# EAGLE design i2c_dev (EAGLE 8.6.0)
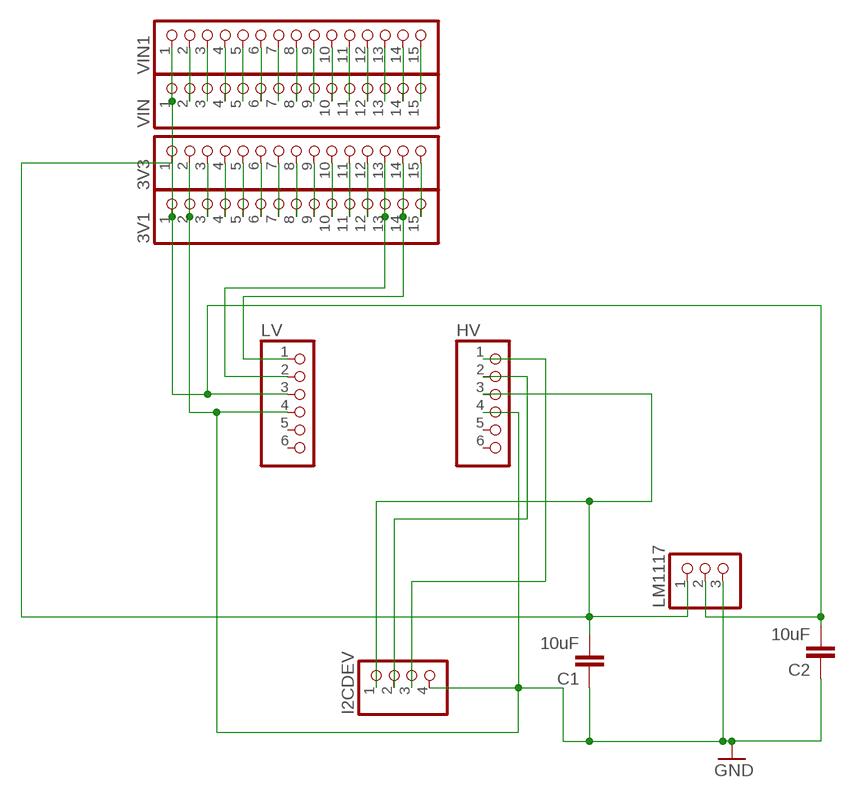
[diagram p0: schematic, sheet 1]

## Parts
3V1  PINHD-1X15  [1X15]
3V3  PINHD-1X15  [1X15]
C1  10uF  C-EU025-025X050  [C025-025X050]
C2  10uF  C-EU025-025X050  [C025-025X050]
HV  PINHD-1X6  [1X06]
I2CDEV  PINHD-1X4  [1X04]
LM1117  PINHD-1X3  [1X03]
LV  PINHD-1X6  [1X06]
VIN  PINHD-1X15  [1X15]
VIN1  PINHD-1X15  [1X15]

## Nets
GND: 3V1.2 3V3.2 C1.1 C2.1 HV.4 I2CDEV.4 LM1117.3 LV.4
I2C_DEV: HV.2 I2CDEV.2
N$1: 3V1.14 3V3.14 LV.1
N$2: 3V1.1 3V3.1 C2.2 LM1117.2 LV.3
N$3: C1.2 HV.3 I2CDEV.1 LM1117.1 VIN1.1 VIN.1
N$4: HV.1 I2CDEV.3
N$6: 3V1.13 3V3.13 LV.2
N$7: VIN1.15 VIN.15
N$8: VIN1.14 VIN.14
N$9: VIN1.13 VIN.13
N$10: VIN1.12 VIN.12
N$11: VIN1.11 VIN.11
N$12: VIN1.10 VIN.10
N$13: VIN1.9 VIN.9
N$14: VIN1.8 VIN.8
N$15: VIN1.7 VIN.7
N$16: VIN1.6 VIN.6
N$17: VIN1.5 VIN.5
N$18: VIN1.4 VIN.4
N$19: VIN1.3 VIN.3
N$20: VIN1.2 VIN.2
N$21: 3V1.3 3V3.3
N$22: 3V1.4 3V3.4
N$23: 3V1.5 3V3.5
N$24: 3V1.6 3V3.6
N$25: 3V1.7 3V3.7
N$26: 3V1.8 3V3.8
N$27: 3V1.9 3V3.9
N$28: 3V1.10 3V3.10
N$29: 3V1.11 3V3.11
N$30: 3V1.12 3V3.12
N$31: 3V1.15 3V3.15
Unconnected: HV.5 HV.6 LV.5 LV.6

## Library data of the parts
3V1 3V3 VIN VIN1 = pinhead:PINHD-1X15: PIN HEADER
C1 C2 = resistor:C-EU: CAPACITOR, European symbol
HV LV = pinhead:PINHD-1X6: PIN HEADER
I2CDEV = pinhead:PINHD-1X4: PIN HEADER
LM1117 = pinhead:PINHD-1X3: PIN HEADER

## Board
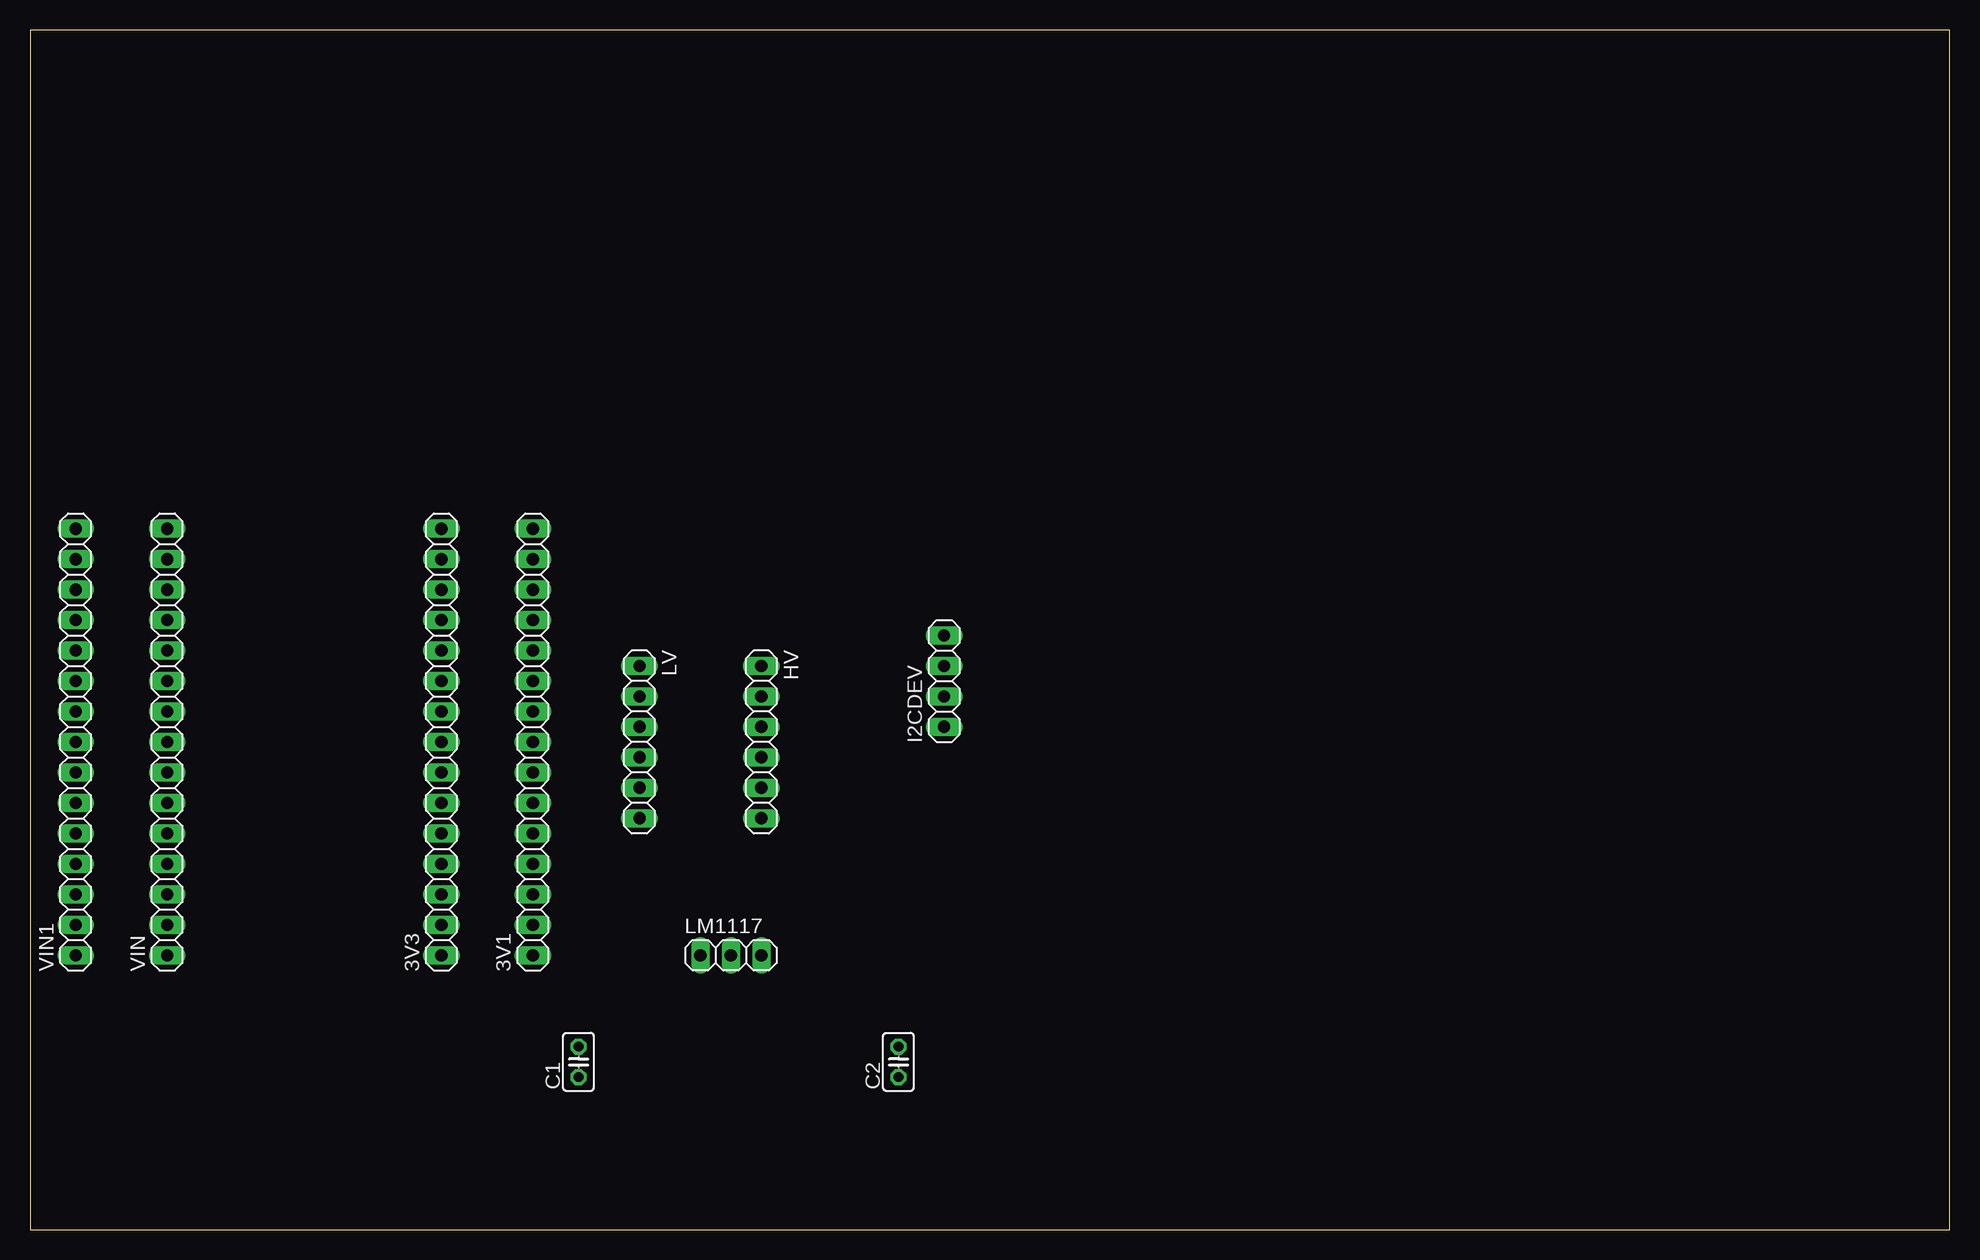
[diagram p1: board, top side]
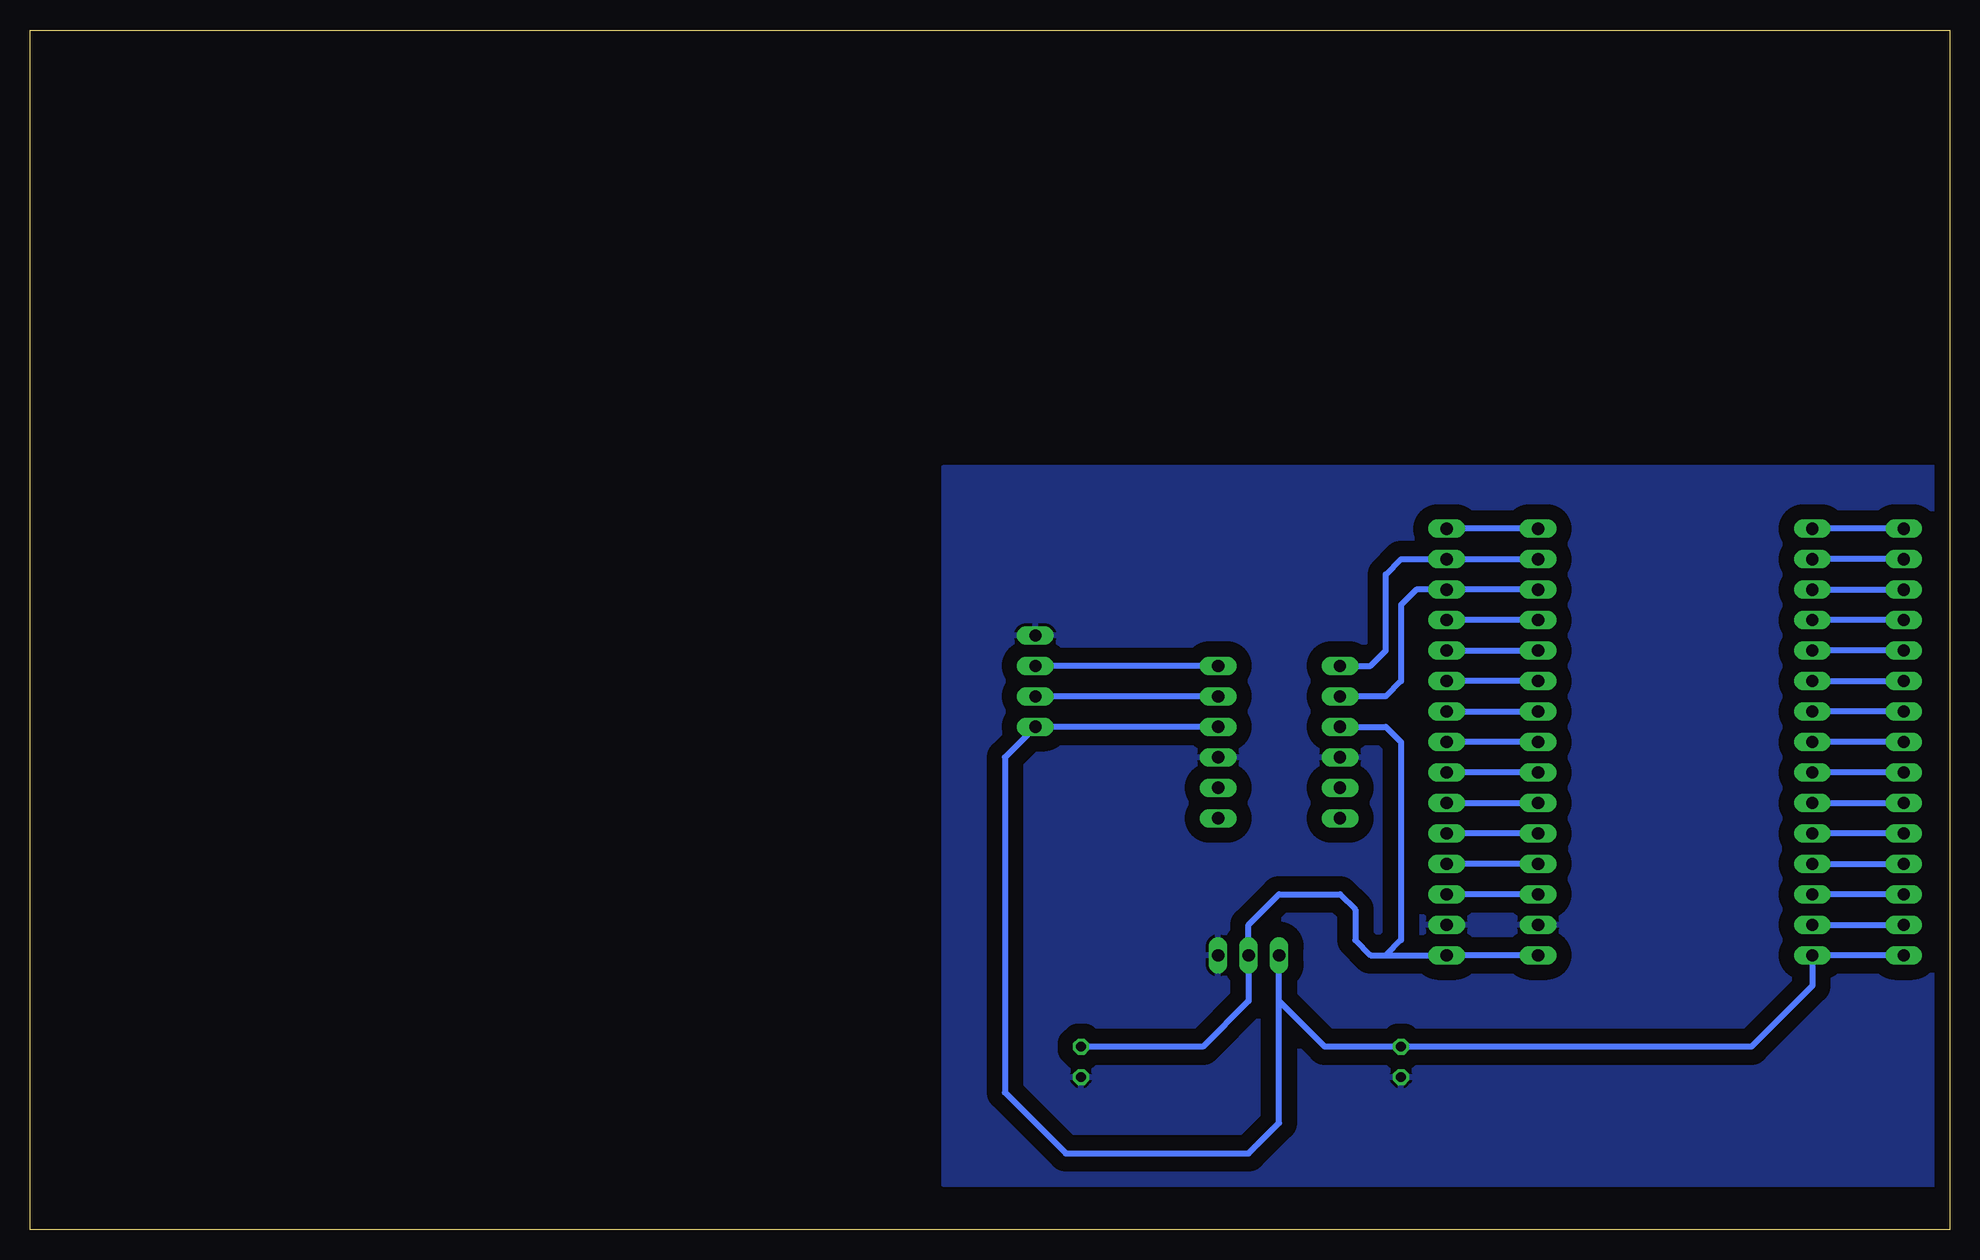
[diagram p2: board, bottom side, seen from below]

Size 160 x 100 mm. Coordinates in mm from the lower left corner, seen from the top.
Outline: 0,0 160,0 160,100 0,100 0,0
Copper layers (1*16): Top 0.035mm / dielectric 1.5mm / Bottom 0.035mm
Design rules "default": minimum track width 6mil, minimum drill 0.35mm, track to track 6mil, track to pad 6mil, pad to pad 6mil, via to via 6mil, smd to smd 6mil, copper to edge 40mil, drill to drill 6mil, minimum pad ring 10mil, minimum via ring 8mil, stop-mask expansion 4mil, vias tented up to drill 0mil, thermal gap 10mil

### Footprints (pad centres in the part's own frame; a part is rotated, then mirrored left to right if it is on the bottom)
1X15 = drill 1.016 long: 1 -17.78,0; 2 -15.24,0; 3 -12.7,0; 4 -10.16,0; 5 -7.62,0; 6 -5.08,0; 7 -2.54,0; 8 0,0; 9 2.54,0; 10 5.08,0; 11 7.62,0; 12 10.16,0; 13 12.7,0; 14 15.24,0; 15 17.78,0
C025-025X050 = drill 0.813 octagon: 1 -1.27,0; 2 1.27,0
1X06 = drill 1.016 long: 1 -6.35,0; 2 -3.81,0; 3 -1.27,0; 4 1.27,0; 5 3.81,0; 6 6.35,0
1X04 = drill 1.016 long: 1 -3.81,0; 2 -1.27,0; 3 1.27,0; 4 3.81,0
1X03 = drill 1.016 long: 1 -2.54,0; 2 0,0; 3 2.54,0

### Placement (x,y rotation side)
3V1  41.91,40.64 90 top
3V3  34.29,40.64 90 top
C1  45.72,13.97 90 top
C2  72.39,13.97 90 top
HV  60.96,40.64 270 top
I2CDEV  76.2,45.72 90 top
LM1117  58.42,22.86 0 top
LV  50.8,40.64 270 top
VIN  11.43,40.64 90 top
VIN1  3.81,40.64 90 top

### Tracks (layer width: path | path; a pad name or v marks a point on that pad's centre or on a via)
GND
  pour Bottom (isolate 1.27): 0,63.5 83.82,63.5 83.82,3.81 0,3.81
I2C_DEV
  Bottom 0.508: HV.2 I2CDEV.2
N$1
  Bottom 0.508: 3V3.14 3V1.14 45.72,55.88 46.99,54.61 46.99,48.26 48.26,46.99 LV.1
N$2
  Bottom 0.508: LM1117.2 58.42,19.05 62.23,15.24 C2.2 | 58.42,24.13 LM1117.2 | 3V3.1 3V1.1 46.99,22.86 | LM1117.2 58.42,25.4 55.88,27.94 50.8,27.94 49.53,26.67 49.53,24.13 48.26,22.86 46.99,22.86 | LV.3 46.99,41.91 45.72,40.64 45.72,24.13 46.99,22.86
N$3
  Bottom 0.508: 55.88,19.05 52.07,15.24 C1.2 16.51,15.24 11.43,20.32 VIN.1 VIN1.1 | 55.88,19.05 LM1117.1 | HV.3 I2CDEV.1 78.74,39.37 78.74,11.43 73.66,6.35 58.42,6.35 55.88,8.89 55.88,19.05
N$4
  Bottom 0.508: HV.1 I2CDEV.3
N$6
  Bottom 0.508: 3V3.13 3V1.13 44.45,53.34 45.72,52.07 45.72,45.72 46.99,44.45 LV.2
N$7
  Bottom 0.508: VIN1.15 VIN.15
N$8
  Bottom 0.508: VIN1.14 VIN.14
N$9
  Bottom 0.508: VIN.13 VIN1.13
N$10
  Bottom 0.508: VIN1.12 VIN.12
N$11
  Bottom 0.508: VIN1.11 VIN.11
N$12
  Bottom 0.508: VIN.10 VIN1.10
N$13
  Bottom 0.508: VIN1.9 VIN.9
N$14
  Bottom 0.508: VIN1.8 VIN.8
N$15
  Bottom 0.508: VIN1.7 VIN.7
N$16
  Bottom 0.508: VIN.6 VIN1.6
N$17
  Bottom 0.508: VIN1.5 VIN.5
N$18
  Bottom 0.508: VIN.4 VIN1.4
N$19
  Bottom 0.508: VIN1.3 VIN.3
N$20
  Bottom 0.508: VIN.2 VIN1.2
N$21
  Bottom 0.508: 3V3.3 3V1.3
N$22
  Bottom 0.508: 3V3.4 3V1.4
N$23
  Bottom 0.508: 3V3.5 3V1.5
N$24
  Bottom 0.508: 3V1.6 3V3.6
N$25
  Bottom 0.508: 3V3.7 3V1.7
N$26
  Bottom 0.508: 3V3.8 3V1.8
N$27
  Bottom 0.508: 3V1.9 3V3.9
N$28
  Bottom 0.508: 3V3.10 3V1.10
N$29
  Bottom 0.508: 3V1.11 3V3.11
N$30
  Bottom 0.508: 3V3.12 3V1.12
N$31
  Bottom 0.508: 3V3.15 3V1.15